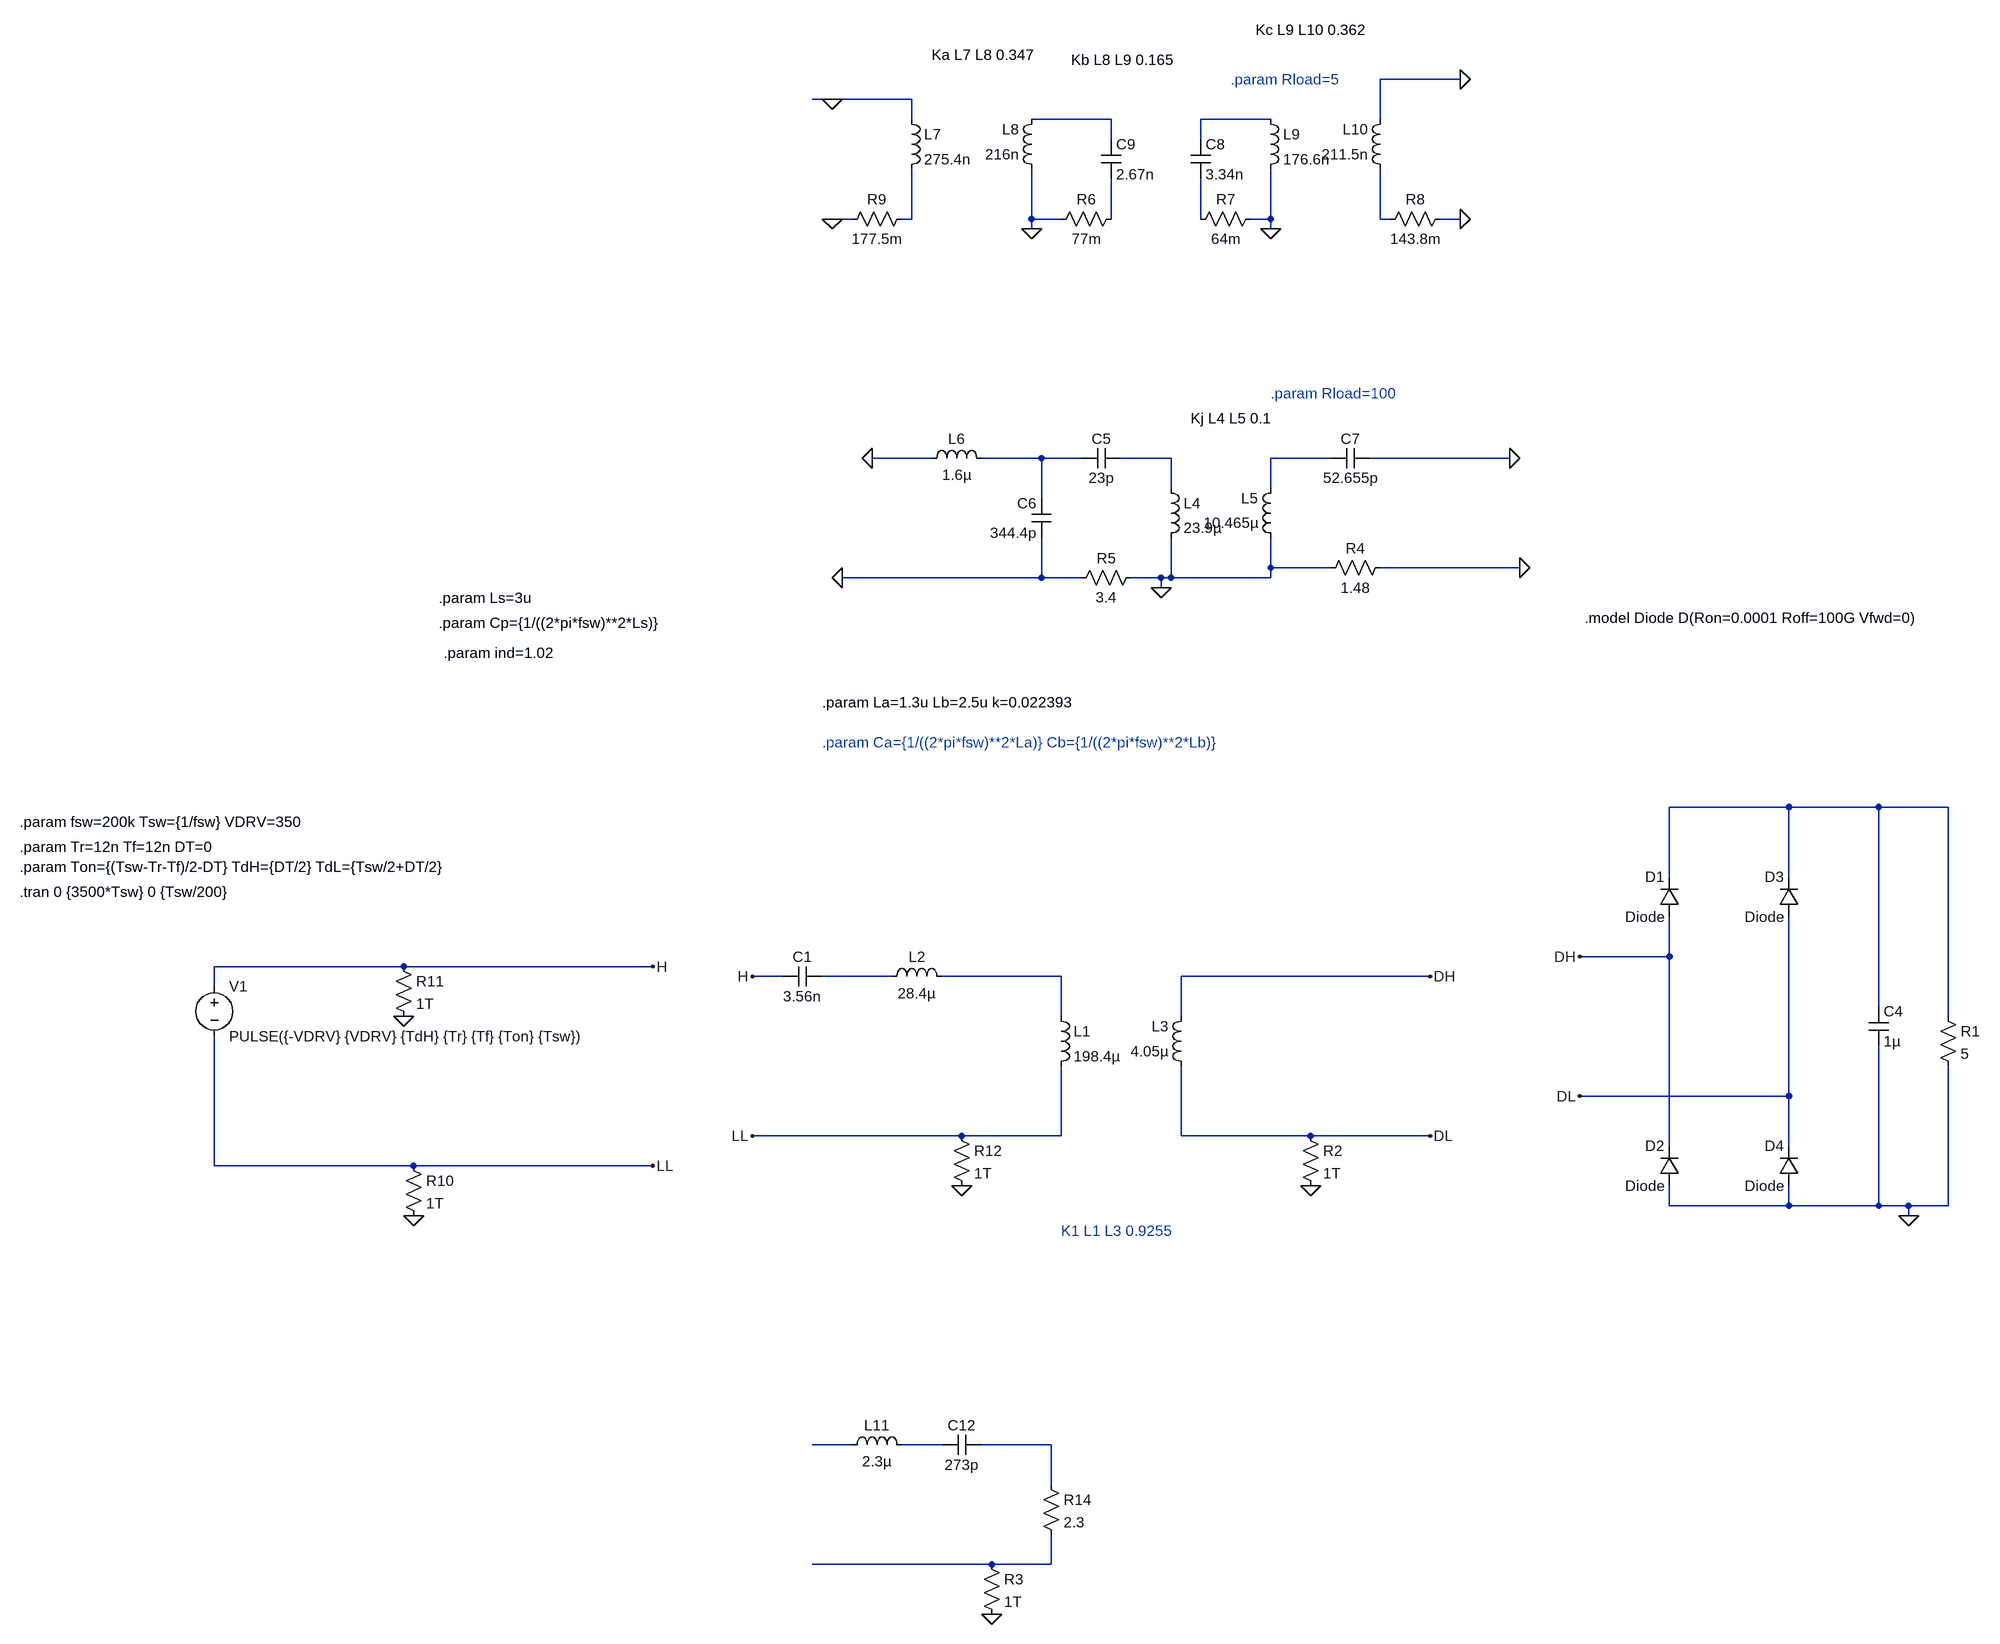
[diagram p0: schematic LLC.asc]
LLC.asc, the LTspice schematic file:
Version 4.1
SHEET 1 2908 1140
WIRE 2048 -1344 1920 -1344
WIRE 1040 -1312 1008 -1312
WIRE 1168 -1312 1040 -1312
WIRE 1168 -1280 1168 -1312
WIRE 1488 -1280 1360 -1280
WIRE 1744 -1280 1632 -1280
WIRE 1920 -1280 1920 -1344
WIRE 1488 -1248 1488 -1280
WIRE 1632 -1248 1632 -1280
WIRE 1040 -1120 1024 -1120
WIRE 1072 -1120 1040 -1120
WIRE 1168 -1120 1168 -1200
WIRE 1168 -1120 1152 -1120
WIRE 1360 -1120 1360 -1200
WIRE 1408 -1120 1360 -1120
WIRE 1488 -1120 1488 -1184
WIRE 1632 -1120 1632 -1184
WIRE 1744 -1120 1744 -1200
WIRE 1744 -1120 1712 -1120
WIRE 1920 -1120 1920 -1200
WIRE 1936 -1120 1920 -1120
WIRE 2048 -1120 2016 -1120
WIRE 1360 -1104 1360 -1120
WIRE 1744 -1104 1744 -1120
WIRE 1200 -736 1104 -736
WIRE 1376 -736 1280 -736
WIRE 1440 -736 1376 -736
WIRE 1584 -736 1504 -736
WIRE 1840 -736 1744 -736
WIRE 2128 -736 1904 -736
WIRE 1584 -688 1584 -736
WIRE 1744 -688 1744 -736
WIRE 1376 -672 1376 -736
WIRE 1744 -560 1744 -608
WIRE 1840 -560 1744 -560
WIRE 2144 -560 1920 -560
WIRE 1376 -544 1376 -608
WIRE 1376 -544 1056 -544
WIRE 1440 -544 1376 -544
WIRE 1568 -544 1520 -544
WIRE 1584 -544 1584 -608
WIRE 1584 -544 1568 -544
WIRE 1744 -544 1744 -560
WIRE 1744 -544 1584 -544
WIRE 1568 -528 1568 -544
WIRE 2576 -176 2384 -176
WIRE 2720 -176 2576 -176
WIRE 2832 -176 2720 -176
WIRE 2384 -64 2384 -176
WIRE 2576 -64 2576 -176
WIRE 2384 64 2384 0
WIRE 2384 64 2240 64
WIRE 352 80 48 80
WIRE 752 80 352 80
WIRE 960 96 912 96
WIRE 1136 96 1024 96
WIRE 1408 96 1216 96
WIRE 2000 96 1600 96
WIRE 48 112 48 80
WIRE 2720 144 2720 -176
WIRE 1408 160 1408 96
WIRE 1600 160 1600 96
WIRE 2832 160 2832 -176
WIRE 2576 288 2576 0
WIRE 2576 288 2240 288
WIRE 1248 352 912 352
WIRE 1408 352 1408 240
WIRE 1408 352 1248 352
WIRE 1600 352 1600 240
WIRE 1808 352 1600 352
WIRE 2000 352 1808 352
WIRE 2384 368 2384 64
WIRE 2576 368 2576 288
WIRE 48 400 48 192
WIRE 368 400 48 400
WIRE 752 400 368 400
WIRE 2384 464 2384 432
WIRE 2576 464 2576 432
WIRE 2576 464 2384 464
WIRE 2720 464 2720 208
WIRE 2720 464 2576 464
WIRE 2768 464 2720 464
WIRE 2832 464 2832 240
WIRE 2832 464 2768 464
WIRE 2768 480 2768 464
WIRE 1072 848 1008 848
WIRE 1216 848 1152 848
WIRE 1392 848 1280 848
WIRE 1392 912 1392 848
WIRE 1296 1040 1008 1040
WIRE 1392 1040 1392 992
WIRE 1392 1040 1296 1040
FLAG 1568 -528 0
FLAG 752 80 H
FLAG 752 400 LL
FLAG 2240 64 DH
FLAG 2240 288 DL
FLAG 1744 -1104 0
FLAG 1360 -1104 0
FLAG 2768 480 0
FLAG 1104 -736 0
FLAG 1056 -544 0
FLAG 2144 -560 0
FLAG 2128 -736 0
FLAG 2048 -1344 0
FLAG 2048 -1120 0
FLAG 1040 -1312 0
FLAG 1040 -1120 0
FLAG 352 160 0
FLAG 368 480 0
FLAG 1808 432 0
FLAG 912 352 LL
FLAG 912 96 H
FLAG 1296 1120 0
FLAG 1248 432 0
FLAG 2000 96 DH
FLAG 2000 352 DL
SYMBOL voltage 48 96 R0
WINDOW 123 0 0 Left 0
WINDOW 39 0 0 Left 0
SYMATTR InstName V1
SYMATTR Value PULSE({-VDRV} {VDRV} {TdH} {Tr} {Tf} {Ton} {Tsw})
SYMBOL res 2816 144 R0
SYMATTR InstName R1
SYMATTR Value 5
SYMBOL diode 2400 0 R180
WINDOW 0 24 64 Left 2
WINDOW 3 24 0 Left 2
SYMATTR InstName D1
SYMATTR Value Diode
SYMBOL cap 2704 144 R0
SYMATTR InstName C4
SYMATTR Value 1µ
SYMBOL diode 2400 432 R180
WINDOW 0 24 64 Left 2
WINDOW 3 24 0 Left 2
SYMATTR InstName D2
SYMATTR Value Diode
SYMBOL diode 2592 0 R180
WINDOW 0 24 64 Left 2
WINDOW 3 24 0 Left 2
SYMATTR InstName D3
SYMATTR Value Diode
SYMBOL diode 2592 432 R180
WINDOW 0 24 64 Left 2
WINDOW 3 24 0 Left 2
SYMATTR InstName D4
SYMATTR Value Diode
SYMBOL cap 1504 -752 R90
WINDOW 0 0 32 VBottom 2
WINDOW 3 32 32 VTop 2
SYMATTR InstName C5
SYMATTR Value 23p
SYMBOL cap 1392 -608 R180
WINDOW 0 24 56 Left 2
WINDOW 3 24 8 Left 2
SYMATTR InstName C6
SYMATTR Value 344.4p
SYMBOL ind 1568 -704 R0
SYMATTR InstName L4
SYMATTR Value 23.9µ
SYMATTR Type ind
SYMATTR SpiceLine Rser=1m
SYMBOL ind 1760 -592 R180
WINDOW 0 36 80 Left 2
WINDOW 3 36 40 Left 2
SYMATTR InstName L5
SYMATTR Value 10.465µ
SYMATTR Type ind
SYMATTR SpiceLine Rser=1m
SYMBOL cap 1904 -752 R90
WINDOW 0 0 32 VBottom 2
WINDOW 3 32 32 VTop 2
SYMATTR InstName C7
SYMATTR Value 52.655p
SYMBOL res 1936 -576 R90
WINDOW 0 0 56 VBottom 2
WINDOW 3 32 56 VTop 2
SYMATTR InstName R4
SYMATTR Value 1.48
SYMBOL res 1536 -560 R90
WINDOW 0 0 56 VBottom 2
WINDOW 3 32 56 VTop 2
SYMATTR InstName R5
SYMATTR Value 3.4
SYMBOL ind 1184 -720 R270
WINDOW 0 32 56 VTop 2
WINDOW 3 5 56 VBottom 2
SYMATTR InstName L6
SYMATTR Value 1.6µ
SYMATTR SpiceLine Rser=1m
SYMBOL ind 1152 -1296 R0
SYMATTR InstName L7
SYMATTR Value 275.4n
SYMATTR Type ind
SYMATTR SpiceLine Rser=1m
SYMBOL ind 1376 -1184 R180
WINDOW 0 36 80 Left 2
WINDOW 3 36 40 Left 2
SYMATTR InstName L8
SYMATTR Value 216n
SYMATTR Type ind
SYMATTR SpiceLine Rser=1m
SYMBOL ind 1728 -1296 R0
SYMATTR InstName L9
SYMATTR Value 176.6n
SYMATTR Type ind
SYMATTR SpiceLine Rser=1m
SYMBOL ind 1936 -1184 R180
WINDOW 0 36 80 Left 2
WINDOW 3 36 40 Left 2
SYMATTR InstName L10
SYMATTR Value 211.5n
SYMATTR Type ind
SYMATTR SpiceLine Rser=1m
SYMBOL res 1504 -1136 R90
WINDOW 0 0 56 VBottom 2
WINDOW 3 32 56 VTop 2
SYMATTR InstName R6
SYMATTR Value 77m
SYMBOL res 1728 -1136 R90
WINDOW 0 0 56 VBottom 2
WINDOW 3 32 56 VTop 2
SYMATTR InstName R7
SYMATTR Value 64m
SYMBOL cap 1472 -1248 R0
SYMATTR InstName C9
SYMATTR Value 2.67n
SYMBOL cap 1616 -1248 R0
SYMATTR InstName C8
SYMATTR Value 3.34n
SYMBOL res 1920 -1104 R270
WINDOW 0 32 56 VTop 2
WINDOW 3 0 56 VBottom 2
SYMATTR InstName R8
SYMATTR Value 143.8m
SYMBOL res 1168 -1136 R90
WINDOW 0 0 56 VBottom 2
WINDOW 3 32 56 VTop 2
SYMATTR InstName R9
SYMATTR Value 177.5m
SYMBOL res 352 384 R0
SYMATTR InstName R10
SYMATTR Value 1T
SYMBOL res 336 64 R0
SYMATTR InstName R11
SYMATTR Value 1T
SYMBOL cap 1280 832 R90
WINDOW 0 0 32 VBottom 2
WINDOW 3 32 32 VTop 2
SYMATTR InstName C12
SYMATTR Value 273p
SYMBOL res 1376 896 R0
SYMATTR InstName R14
SYMATTR Value 2.3
SYMBOL ind 1056 864 R270
WINDOW 0 32 56 VTop 2
WINDOW 3 5 56 VBottom 2
SYMATTR InstName L11
SYMATTR Value 2.3µ
SYMATTR SpiceLine Rser=1m
SYMBOL ind 1392 144 R0
SYMATTR InstName L1
SYMATTR Value 198.4µ
SYMATTR SpiceLine Rser=1m
SYMBOL cap 960 112 R270
WINDOW 0 32 32 VTop 2
WINDOW 3 0 32 VBottom 2
SYMATTR InstName C1
SYMATTR Value 3.56n
SYMBOL ind 1120 112 R270
WINDOW 0 32 56 VTop 2
WINDOW 3 5 56 VBottom 2
SYMATTR InstName L2
SYMATTR Value 28.4µ
SYMATTR SpiceLine Rser=1m
SYMBOL ind 1616 256 R180
WINDOW 0 36 80 Left 2
WINDOW 3 36 40 Left 2
SYMATTR InstName L3
SYMATTR Value 4.05µ
SYMATTR SpiceLine Rser=1m
SYMBOL res 1792 336 R0
SYMATTR InstName R2
SYMATTR Value 1T
SYMBOL res 1280 1024 R0
SYMATTR InstName R3
SYMATTR Value 1T
SYMBOL res 1232 336 R0
SYMATTR InstName R12
SYMATTR Value 1T
TEXT -264 -152 Left 2 !.param fsw=200k Tsw={1/fsw} VDRV=350
TEXT -264 -40 Left 2 !.tran 0 {3500*Tsw} 0 {Tsw/200}
TEXT 1024 -344 Left 2 !.param La=1.3u Lb=2.5u k=0.022393
TEXT 1024 -280 Left 2 ;.param Ca={1/((2*pi*fsw)**2*La)} Cb={1/((2*pi*fsw)**2*Lb)}
TEXT 408 -472 Left 2 !.param Cp={1/((2*pi*fsw)**2*Ls)}
TEXT 408 -512 Left 2 !.param Ls=3u
TEXT 416 -424 Left 2 !.param ind=1.02
TEXT 2248 -480 Left 2 !.model Diode D(Ron=0.0001 Roff=100G Vfwd=0)
TEXT 1616 -800 Left 2 !Kj L4 L5 0.1
TEXT 1200 -1384 Left 2 !Ka L7 L8 0.347
TEXT 1424 -1376 Left 2 !Kb L8 L9 0.165
TEXT 1720 -1424 Left 2 !Kc L9 L10 0.362
TEXT 1680 -1344 Left 2 ;.param Rload=5
TEXT 1744 -840 Left 2 ;.param Rload=100
TEXT -264 -112 Left 2 !.param Tr=12n Tf=12n DT=0
TEXT -264 -80 Left 2 !.param Ton={(Tsw-Tr-Tf)/2-DT} TdH={DT/2} TdL={Tsw/2+DT/2}
TEXT 1408 504 Left 2 ;K1 L1 L3 0.9255

The netlist it stands for:
* LLC.asc
V1 H LL PULSE({-VDRV} {VDRV} {TdH} {Tr} {Tf} {Ton} {Tsw})
R1 N010 0 5
D1 DH N010 Diode
C4 N010 0 1µ
D2 0 DH Diode
D3 DL N010 Diode
D4 0 DL Diode
C5 N008 N007 23p
C6 0 N007 344.4p
L4 N008 0 23.9µ Rser=1m
L5 0 N009 10.465µ Rser=1m
C7 0 N009 52.655p
R4 0 0 1.48
R5 0 0 3.4
L6 0 N007 1.6µ Rser=1m
L7 0 N003 275.4n Rser=1m
L8 0 N001 216n Rser=1m
L9 N002 0 176.6n Rser=1m
L10 N006 0 211.5n Rser=1m
R6 N004 0 77m
R7 0 N005 64m
C9 N001 N004 2.67n
C8 N002 N005 3.34n
R8 N006 0 143.8m
R9 N003 0 177.5m
R10 LL 0 1T
R11 H 0 1T
C12 N015 N014 273p
R14 N015 N016 2.3
L11 N013 N014 2.3µ Rser=1m
L1 N012 LL 198.4µ Rser=1m
C1 H N011 3.56n
L2 N011 N012 28.4µ Rser=1m
L3 DL DH 4.05µ Rser=1m
R2 DL 0 1T
R3 N016 0 1T
R12 LL 0 1T
.model D D
.lib standard.dio
.param fsw=200k Tsw={1/fsw} VDRV=350
.tran 0 {3500*Tsw} 0 {Tsw/200}
.param La=1.3u Lb=2.5u k=0.022393
* .param Ca={1/((2*pi*fsw)**2*La)} Cb={1/((2*pi*fsw)**2*Lb)}
.param Cp={1/((2*pi*fsw)**2*Ls)}
.param Ls=3u
.param ind=1.02
.model Diode D(Ron=0.0001 Roff=100G Vfwd=0)
Kj L4 L5 0.1
Ka L7 L8 0.347
Kb L8 L9 0.165
Kc L9 L10 0.362
* .param Rload=5
* .param Rload=100
.param Tr=12n Tf=12n DT=0
.param Ton={(Tsw-Tr-Tf)/2-DT} TdH={DT/2} TdL={Tsw/2+DT/2}
* K1 L1 L3 0.9255
.backanno
.end